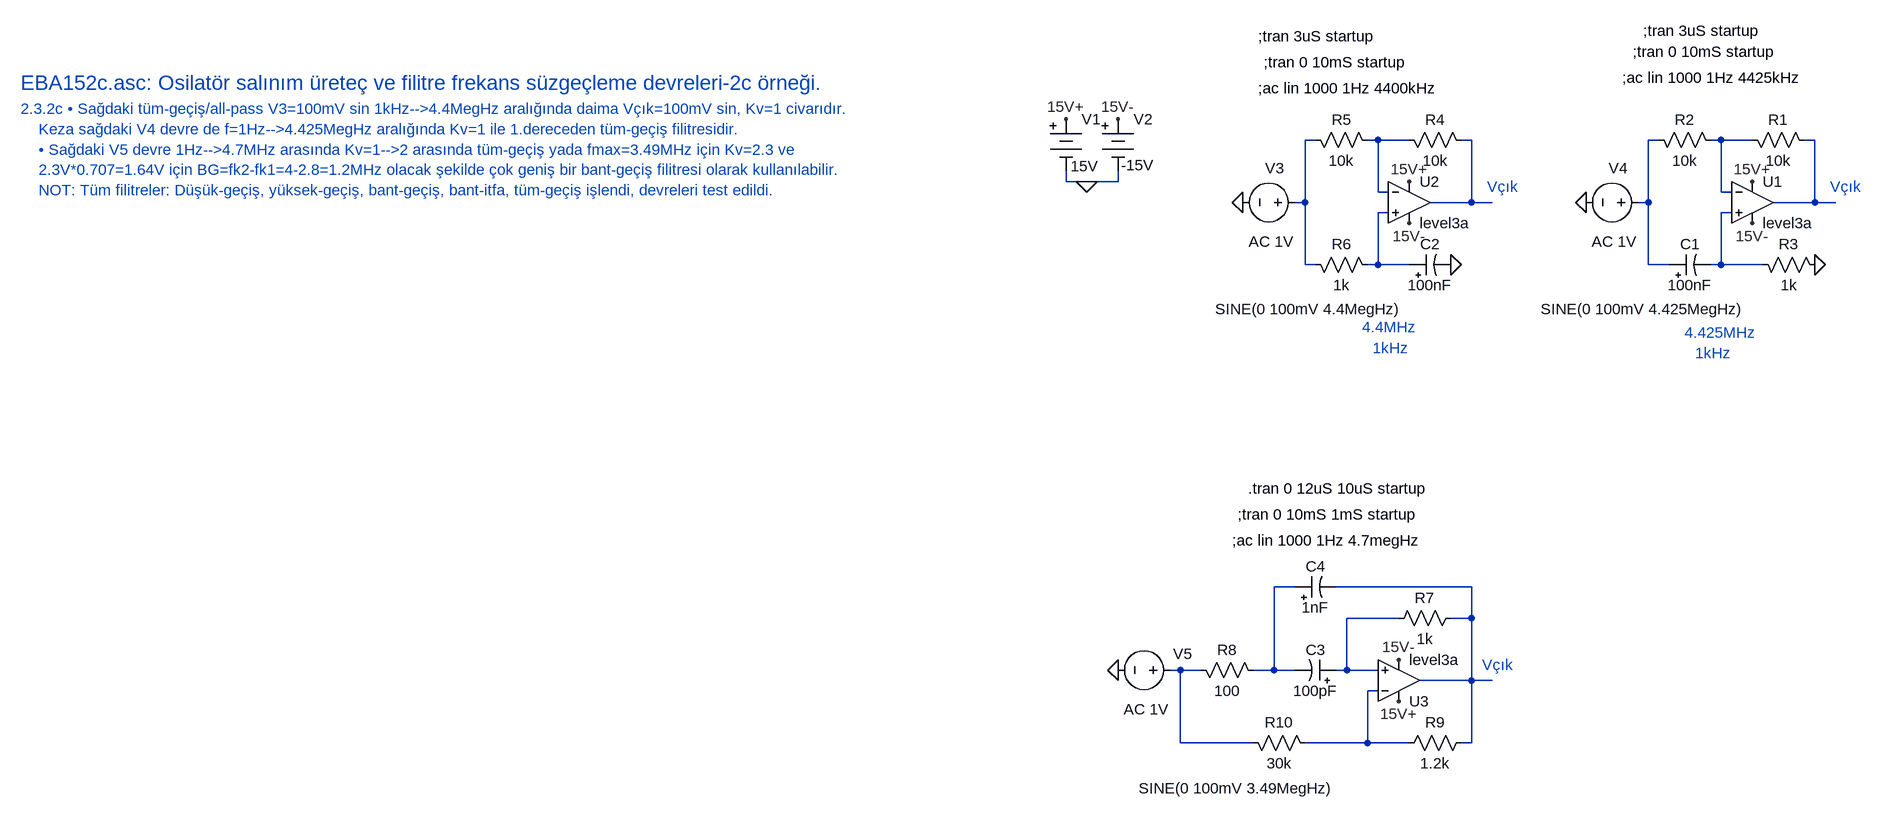
[diagram p0: schematic EBA152c.asc]
EBA152c.asc, the LTspice schematic file:
Version 4
SHEET 1 6044 4332
WIRE 1760 144 1744 144
WIRE 1856 144 1840 144
WIRE 1904 144 1856 144
WIRE 2000 144 1984 144
WIRE 2288 144 2272 144
WIRE 2384 144 2368 144
WIRE 2432 144 2384 144
WIRE 2528 144 2512 144
WIRE 1376 208 1376 192
WIRE 1408 208 1376 208
WIRE 1456 208 1456 192
WIRE 1456 208 1408 208
WIRE 1856 224 1856 144
WIRE 1872 224 1856 224
WIRE 2384 224 2384 144
WIRE 2400 224 2384 224
WIRE 1744 240 1744 144
WIRE 1744 240 1728 240
WIRE 2000 240 2000 144
WIRE 2000 240 1936 240
WIRE 2032 240 2000 240
WIRE 2272 240 2272 144
WIRE 2272 240 2256 240
WIRE 2528 240 2528 144
WIRE 2528 240 2464 240
WIRE 2560 240 2528 240
WIRE 1872 256 1856 256
WIRE 2400 256 2384 256
WIRE 1744 336 1744 240
WIRE 1760 336 1744 336
WIRE 1856 336 1856 256
WIRE 1856 336 1840 336
WIRE 1904 336 1856 336
WIRE 2272 336 2272 240
WIRE 2304 336 2272 336
WIRE 2384 336 2384 256
WIRE 2384 336 2368 336
WIRE 2448 336 2384 336
WIRE 1728 832 1696 832
WIRE 2000 832 1792 832
WIRE 1888 880 1808 880
WIRE 2000 880 2000 832
WIRE 2000 880 1968 880
WIRE 1552 960 1536 960
WIRE 1584 960 1552 960
WIRE 1696 960 1696 832
WIRE 1696 960 1664 960
WIRE 1728 960 1696 960
WIRE 1808 960 1808 880
WIRE 1808 960 1792 960
WIRE 1856 960 1808 960
WIRE 2000 976 2000 880
WIRE 2000 976 1920 976
WIRE 2032 976 2000 976
WIRE 1856 992 1840 992
WIRE 1552 1072 1552 960
WIRE 1664 1072 1552 1072
WIRE 1840 1072 1840 992
WIRE 1840 1072 1744 1072
WIRE 1904 1072 1840 1072
WIRE 2000 1072 2000 976
WIRE 2000 1072 1984 1072
FLAG 2432 272 15V-
FLAG 2432 208 15V+
FLAG 2528 336 0
FLAG 2176 240 0
FLAG 1904 272 15V-
FLAG 1904 208 15V+
FLAG 1968 336 0
FLAG 1648 240 0
FLAG 1888 944 15V-
FLAG 1888 1008 15V+
FLAG 1456 960 0
FLAG 1376 112 15V+
FLAG 1456 112 15V-
FLAG 1408 208 0
SYMBOL OpAmps\\UniversalOpAmp3 2432 240 R0
SYMATTR InstName U1
SYMBOL res 2528 160 M270
WINDOW 0 32 56 VTop 2
WINDOW 3 0 56 VBottom 2
SYMATTR InstName R1
SYMATTR Value 10k
SYMBOL res 2384 160 M270
WINDOW 0 32 56 VTop 2
WINDOW 3 0 56 VBottom 2
SYMATTR InstName R2
SYMATTR Value 10k
SYMBOL polcap 2304 352 R270
WINDOW 0 32 32 VTop 2
WINDOW 3 0 32 VBottom 2
SYMATTR InstName C1
SYMATTR Value 100nF
SYMBOL res 2544 352 M270
WINDOW 0 32 56 VTop 2
WINDOW 3 0 56 VBottom 2
SYMATTR InstName R3
SYMATTR Value 1k
SYMBOL voltage 2272 240 R90
WINDOW 0 -53 32 VRight 2
WINDOW 3 164 -147 VRight 2
WINDOW 123 60 18 VRight 2
WINDOW 39 0 0 Left 0
SYMATTR InstName V4
SYMATTR Value SINE(0 100mV 4.425MegHz)
SYMATTR Value2 AC 1V
SYMBOL OpAmps\\UniversalOpAmp3 1904 240 R0
SYMATTR InstName U2
SYMBOL res 2000 160 M270
WINDOW 0 32 56 VTop 2
WINDOW 3 0 56 VBottom 2
SYMATTR InstName R4
SYMATTR Value 10k
SYMBOL res 1856 160 M270
WINDOW 0 32 56 VTop 2
WINDOW 3 0 56 VBottom 2
SYMATTR InstName R5
SYMATTR Value 10k
SYMBOL polcap 1904 352 R270
WINDOW 0 32 32 VTop 2
WINDOW 3 0 32 VBottom 2
SYMATTR InstName C2
SYMATTR Value 100nF
SYMBOL res 1856 352 M270
WINDOW 0 32 56 VTop 2
WINDOW 3 0 56 VBottom 2
SYMATTR InstName R6
SYMATTR Value 1k
SYMBOL voltage 1744 240 R90
WINDOW 0 -53 32 VRight 2
WINDOW 3 164 -147 VRight 2
WINDOW 123 60 18 VRight 2
WINDOW 39 0 0 Left 0
SYMATTR InstName V3
SYMATTR Value SINE(0 100mV 4.4MegHz)
SYMATTR Value2 AC 1V
SYMBOL OpAmps\\UniversalOpAmp3 1888 976 M180
SYMATTR InstName U3
SYMBOL polcap 1792 976 M270
WINDOW 3 0 32 VBottom 2
WINDOW 0 32 32 VTop 2
SYMATTR Value 100pF
SYMATTR InstName C3
SYMBOL res 1872 896 R270
WINDOW 0 32 56 VTop 2
WINDOW 3 0 56 VBottom 2
SYMATTR InstName R7
SYMATTR Value 1k
SYMBOL voltage 1552 960 R90
WINDOW 0 -25 -18 VRight 2
WINDOW 3 182 -235 VRight 2
WINDOW 123 60 18 VRight 2
WINDOW 39 0 0 Left 0
SYMATTR InstName V5
SYMATTR Value SINE(0 100mV 3.49MegHz)
SYMATTR Value2 AC 1V
SYMBOL res 1680 976 M270
WINDOW 0 32 56 VTop 2
WINDOW 3 0 56 VBottom 2
SYMATTR InstName R8
SYMATTR Value 100
SYMBOL polcap 1728 848 R270
WINDOW 0 32 32 VTop 2
WINDOW 3 0 32 VBottom 2
SYMATTR InstName C4
SYMATTR Value 1nF
SYMBOL res 1888 1088 R270
WINDOW 0 32 56 VTop 2
WINDOW 3 0 56 VBottom 2
SYMATTR InstName R9
SYMATTR Value 1.2k
SYMBOL res 1760 1088 M270
WINDOW 0 32 56 VTop 2
WINDOW 3 0 56 VBottom 2
SYMATTR InstName R10
SYMATTR Value 30k
SYMBOL Misc\\battery 1376 96 R0
WINDOW 3 7 88 Left 2
SYMATTR Value 15V
SYMATTR InstName V1
SYMBOL Misc\\battery 1456 96 R0
WINDOW 3 5 87 Left 2
SYMATTR Value -15V
SYMATTR InstName V2
TEXT -232 56 Left 3 ;EBA152c.asc: Osilatör salınım üreteç ve filitre frekans süzgeçleme devreleri-2c örneği.
TEXT -232 96 Left 2 ;2.3.2c • Sağdaki tüm-geçiş/all-pass V3=100mV sin 1kHz-->4.4MegHz aralığında daima Vçık=100mV sin, Kv=1 civarıdır.\n    Keza sağdaki V4 devre de f=1Hz-->4.425MegHz aralığında Kv=1 ile 1.dereceden tüm-geçiş filitresidir.\n    • Sağdaki V5 devre 1Hz-->4.7MHz arasında Kv=1-->2 arasında tüm-geçiş yada fmax=3.49MHz için Kv=2.3 ve \n    2.3V*0.707=1.64V için BG=fk2-fk1=4-2.8=1.2MHz olacak şekilde çok geniş bir bant-geçiş filitresi olarak kullanılabilir.\n    NOT: Tüm filitreler: Düşük-geçiş, yüksek-geçiş, bant-geçiş, bant-itfa, tüm-geçiş işlendi, devreleri test edildi.
TEXT 2552 216 Left 2 ;Vçık
TEXT 1672 64 Left 2 !;ac lin 1000 1Hz 4400kHz
TEXT 2024 216 Left 2 ;Vçık
TEXT 2016 952 Left 2 ;Vçık
TEXT 1632 760 Left 2 !;ac lin 1000 1Hz 4.7megHz
TEXT 1832 432 Left 2 ;4.4MHz
TEXT 1680 24 Left 2 !;tran 0 10mS startup
TEXT 1672 -16 Left 2 !;tran 3uS startup
TEXT 1848 464 Left 2 ;1kHz
TEXT 2232 48 Left 2 !;ac lin 1000 1Hz 4425kHz
TEXT 2328 440 Left 2 ;4.425MHz
TEXT 2344 472 Left 2 ;1kHz
TEXT 2248 8 Left 2 !;tran 0 10mS startup
TEXT 2264 -24 Left 2 !;tran 3uS startup
TEXT 1640 720 Left 2 !;tran 0 10mS 1mS startup
TEXT 1656 680 Left 2 !.tran 0 12uS 10uS startup

The netlist it stands for:
* EBA152c.asc
XU1 N008 N005 15V+ 15V- N006 level3a  ; pins In+ In- V+ V- OUT
R1 N006 N005 10k
R2 N005 N004 10k
C1 N004 N008 100nF
R3 0 N008 1k
V4 N004 0 SINE(0 100mV 4.425MegHz) AC 1V
XU2 N007 N002 15V+ 15V- N003 level3a  ; pins In+ In- V+ V- OUT
R4 N003 N002 10k
R5 N002 N001 10k
C2 N007 0 100nF
R6 N007 N001 1k
V3 N001 0 SINE(0 100mV 4.4MegHz) AC 1V
XU3 N011 N013 15V+ 15V- N010 level3a  ; pins In+ In- V+ V- OUT
C3 N011 N009 100pF
R7 N011 N010 1k
V5 N012 0 SINE(0 100mV 3.49MegHz) AC 1V
R8 N009 N012 100
C4 N009 N010 1nF
R9 N013 N010 1.2k
R10 N013 N012 30k
V1 15V+ 0 15V
V2 15V- 0 -15V
* EBA152c.asc: Osilatör salınım üreteç ve filitre frekans süzgeçleme devreleri-2c örneği.
* 2.3.2c • Sağdaki tüm-geçiş/all-pass V3=100mV sin 1kHz-->4.4MegHz aralığında daima Vçık=100mV sin, Kv=1 civarıdır.
*     Keza sağdaki V4 devre de f=1Hz-->4.425MegHz aralığında Kv=1 ile 1.dereceden tüm-geçiş filitresidir.
*     • Sağdaki V5 devre 1Hz-->4.7MHz arasında Kv=1-->2 arasında tüm-geçiş yada fmax=3.49MHz için Kv=2.3 ve
*     2.3V*0.707=1.64V için BG=fk2-fk1=4-2.8=1.2MHz olacak şekilde çok geniş bir bant-geçiş filitresi olarak kullanılabilir.
*     NOT: Tüm filitreler: Düşük-geçiş, yüksek-geçiş, bant-geçiş, bant-itfa, tüm-geçiş işlendi, devreleri test edildi.
* Vçık
;ac lin 1000 1Hz 4400kHz
* Vçık
* Vçık
;ac lin 1000 1Hz 4.7megHz
* 4.4MHz
;tran 0 10mS startup
;tran 3uS startup
* 1kHz
;ac lin 1000 1Hz 4425kHz
* 4.425MHz
* 1kHz
;tran 0 10mS startup
;tran 3uS startup
;tran 0 10mS 1mS startup
.tran 0 12uS 10uS startup
.backanno
.end